# EAGLE design adsr2 (EAGLE 7.1.0)
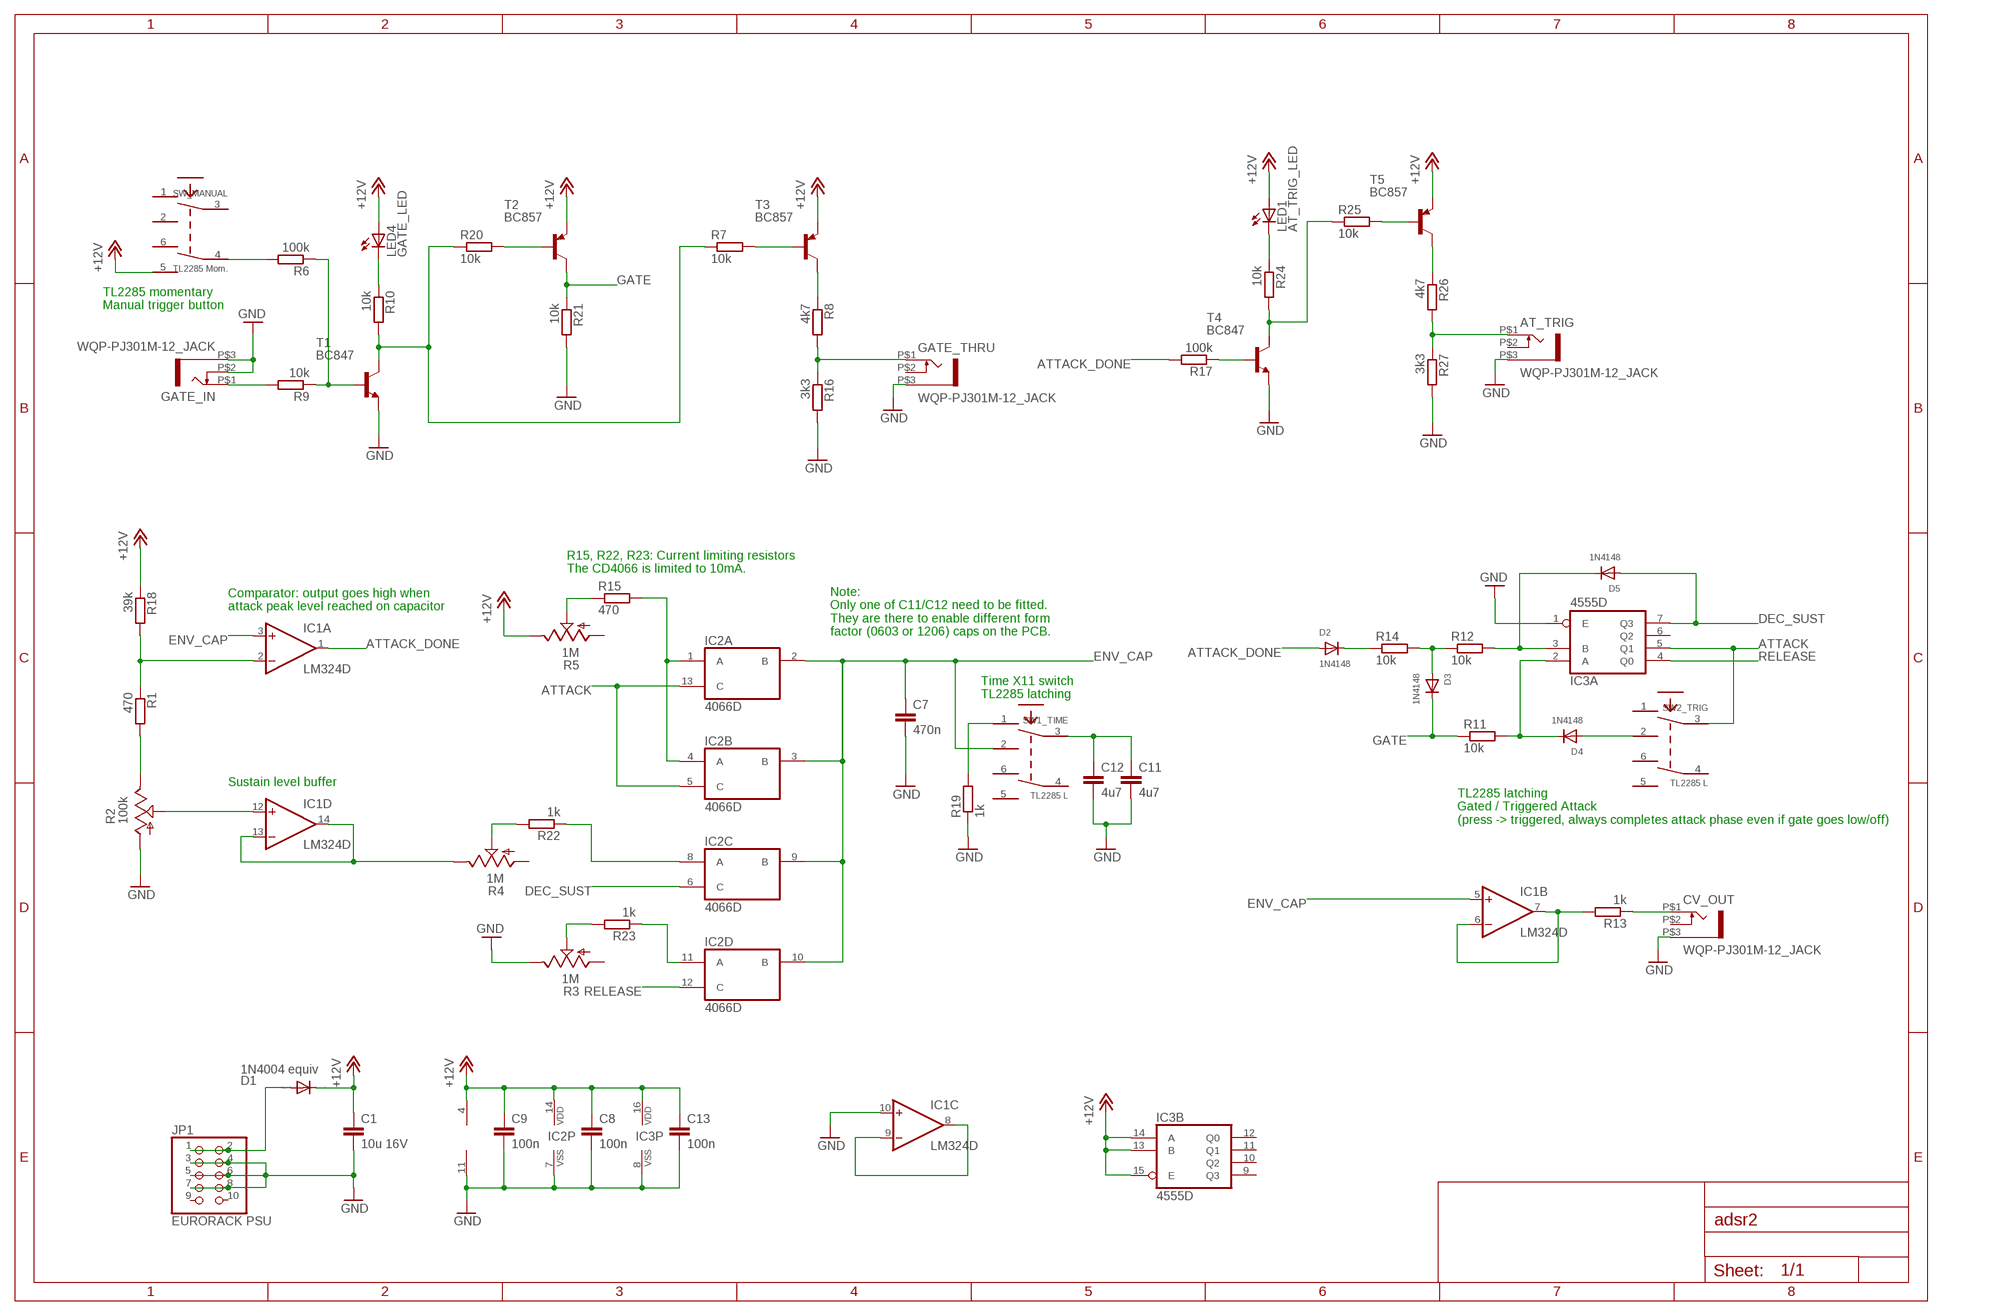
[diagram p0: schematic, sheet 1]

## Parts
AT_TRIG  WQP-PJ301M-12_JACK  [WQP-PJ301M-12_JACK]
C1  10u 16V  C-EUC1206K  [C1206K]
C7  470n  C-EUC0603K  [C0603K]
C8  100n  C-EUC0603K  [C0603K]
C9  100n  C-EUC0603K  [C0603K]
C11  4u7  C-EUC1206K  [C1206K]
C12  4u7  C-EUC0603K  [C0603K]
C13  100n  C-EUC0603K  [C0603K]
CV_OUT  WQP-PJ301M-12_JACK  [WQP-PJ301M-12_JACK]
D1  1N4004 equiv  DIODE-DO214AA  [DO214AA]
D2  1N4148  DIODESOD-323F  [SOD-323F]
D3  1N4148  DIODESOD-323F  [SOD-323F]
D4  1N4148  DIODESOD-323F  [SOD-323F]
D5  1N4148  DIODESOD-323F  [SOD-323F]
GATE_IN  WQP-PJ301M-12_JACK  [WQP-PJ301M-12_JACK]
GATE_THRU  WQP-PJ301M-12_JACK  [WQP-PJ301M-12_JACK]
IC1  LM324D  [SO14]
IC2  4066D  [SO14]
IC3  4555D  [SO16]
JP1  EURORACK PSU  PINHD-2X5  [2X05]
LED1  AT_TRIG_LED  LED3MM  [LED3MM]
LED4  GATE_LED  LED3MM  [LED3MM]
R1  470  R-EU_R0603  [R0603]
R2  100k  POT_USVERTICAL  [ALPS_POT_VERTICAL]
R3  1M  POT_USVERTICAL  [ALPS_POT_VERTICAL]
R4  1M  POT_USVERTICAL  [ALPS_POT_VERTICAL]
R5  1M  POT_USVERTICAL  [ALPS_POT_VERTICAL]
R6  100k  R-EU_R0603  [R0603]
R7  10k  R-EU_R0603  [R0603]
R8  4k7  R-EU_R0603  [R0603]
R9  10k  R-EU_R0603  [R0603]
R10  10k  R-EU_R0603  [R0603]
R11  10k  R-EU_R0603  [R0603]
R12  10k  R-EU_R0603  [R0603]
R13  1k  R-EU_R0603  [R0603]
R14  10k  R-EU_R0603  [R0603]
R15  470  R-EU_R0603  [R0603]
R16  3k3  R-EU_R0603  [R0603]
R17  100k  R-EU_R0603  [R0603]
R18  39k  R-EU_R0603  [R0603]
R19  1k  R-EU_R0603  [R0603]
R20  10k  R-EU_R0603  [R0603]
R21  10k  R-EU_R0603  [R0603]
R22  1k  R-EU_R0603  [R0603]
R23  1k  R-EU_R0603  [R0603]
R24  10k  R-EU_R0603  [R0603]
R25  10k  R-EU_R0603  [R0603]
R26  4k7  R-EU_R0603  [R0603]
R27  3k3  R-EU_R0603  [R0603]
SW1_TIME  TL2285 L  TL2285  [TL2285_PCB]
SW2_TRIG  TL2285 L  TL2285  [TL2285_PCB]
SW_MANUAL  TL2285 Mom.  TL2285  [TL2285_PCB]
T1  BC847  [SOT23]
T2  BC857  BC857A-PNP-SOT23-BEC  [SOT23-BEC]
T3  BC857  BC857A-PNP-SOT23-BEC  [SOT23-BEC]
T4  BC847  [SOT23]
T5  BC857  BC857A-PNP-SOT23-BEC  [SOT23-BEC]

## Nets
+12V: C1.1 C8.1 C9.1 C13.1 D1.C IC1.4(P:V+) IC2.14(P:VDD) IC3.13(B:B) IC3.14(B:A) IC3.15(B:E) IC3.16(P:VDD) LED1.A LED4.A R5.P$1(E) R18.1 SW_MANUAL.5 T2.E T3.E T5.E
ATTACK: IC2.5(B:C) IC2.13(A:C) IC3.5(A:Q1) SW2_TRIG.3
ATTACK_DONE: D2.A IC1.1(A:OUT) R17.2
ATTACK_REF: IC1.2(A:-IN) R1.1 R18.2
DEC_SUST: D5.A IC2.6(C:C) IC3.7(A:Q3)
ENV_CAP: C7.1 IC1.3(A:+IN) IC1.5(B:+IN) IC2.2(A:B) IC2.3(B:B) IC2.9(C:B) IC2.10(D:B) SW1_TIME.2
GATE: D3.C R11.1 R21.1 T2.C
GATE_IN: R7.1 R10.2 R20.1 T1.3(C)
GND: AT_TRIG.P$3 C1.2 C7.2 C8.2 C9.2 C11.2 C12.2 C13.2 CV_OUT.P$3 GATE_IN.P$2 GATE_IN.P$3 GATE_THRU.P$3 IC1.10(C:+IN) IC1.11(P:V-) IC2.7(P:VSS) IC3.1(A:E) IC3.8(P:VSS) JP1.3 JP1.4 JP1.5 JP1.6 JP1.7 JP1.8 R2.P$3(A) R3.P$1(E) R16.2 R19.1 R21.2 R27.2 T1.2(E) T4.2(E)
N$1: R20.2 T2.B
N$2: GATE_IN.P$1 R9.2
N$3: D1.A JP1.1 JP1.2
N$4: R6.2 SW_MANUAL.4
N$5: IC2.11(D:A) R23.1
N$6: IC2.8(C:A) R22.1
N$7: IC1.13(D:-IN) IC1.14(D:OUT) R4.P$1(E)
N$8: R7.2 T3.B
N$9: R8.1 T3.C
N$10: IC2.1(A:A) IC2.4(B:A) R15.2
N$11: CV_OUT.P$1 R13.1
N$12: IC1.6(B:-IN) IC1.7(B:OUT) R13.2
N$13: GATE_THRU.P$1 R8.2 R16.1
N$15: R4.P$2(S) R22.2
N$16: C11.1 C12.1 SW1_TIME.3
N$17: D3.A R12.1 R14.2
N$18: R19.2 SW1_TIME.1
N$19: R17.1 T4.1(B)
N$20: D5.C IC3.3(A:B) R12.2
N$21: R6.1 R9.1 T1.1(B)
N$22: LED4.K(C) R10.1
N$23: R3.P$2(S) R23.2
N$24: IC1.8(C:OUT) IC1.9(C:-IN)
N$25: D4.C IC3.2(A:A) R11.2
N$26: R1.2 R2.P$1(E)
N$27: D4.A SW2_TRIG.2
N$28: R5.P$2(S) R15.1
N$29: D2.C R14.1
N$30: R24.2 R25.1 T4.3(C)
N$31: LED1.K(C) R24.1
N$33: R25.2 T5.B
N$34: R26.1 T5.C
N$35: AT_TRIG.P$1 R26.2 R27.1
RELEASE: IC2.12(D:C) IC3.4(A:Q0)
SUST_LEVEL: IC1.12(D:+IN) R2.P$2(S)
Unconnected: AT_TRIG.P$2 CV_OUT.P$2 GATE_THRU.P$2 IC3.6(A:Q2) IC3.9(B:Q3) IC3.10(B:Q2) IC3.11(B:Q1) IC3.12(B:Q0) JP1.9 JP1.10 R3.P$3(A) R4.P$3(A) R5.P$3(A) SW1_TIME.4 SW1_TIME.5 SW1_TIME.6 SW2_TRIG.1 SW2_TRIG.4 SW2_TRIG.5 SW2_TRIG.6 SW_MANUAL.1 SW_MANUAL.2 SW_MANUAL.3 SW_MANUAL.6

## Notes on the sheet
- TL2285 momentary
  Manual trigger button
- R15, R22, R23: Current limiting resistors
  The CD4066 is limited to 10mA.
- Comparator: output goes high when
  attack peak level reached on capacitor
- Note:
  Only one of C11/C12 need to be fitted.
  They are there to enable different form
  factor (0603 or 1206) caps on the PCB.
- Time X11 switch
  TL2285 latching
- Sustain level buffer
- TL2285 latching
  Gated / Triggered Attack
  (press -> triggered, always completes attack phase even if gate goes low/off)

## Library data of the parts
AT_TRIG CV_OUT GATE_IN GATE_THRU = thonkiconn:WQP-PJ301M-12_JACK
C1 C7-C9 C11-C13 = rcl:C-EU: CAPACITOR, European symbol
D1 = diode:DIODE-: DIODE
D2-D5 = adafruit:DIODE: Diode SMADIODE - SMA Surface Mount Package 20V 1A Schottky Diode Digikey: 641-1014-6-ND DO-1N4148 - Through Hole Small Current Diode SOD-123 20V 1 A (.5mV Vf) Schottky Diode - Digikey: MBRX120TPMSCT-ND SOD-323 10V 570mA (.38mV Vf, 3ns) Schottky Diode - Digikey: ZLLS410CT-ND SOD-523 30V 30mA Schottky Diode (RB751S-40TE61) - Digikey: RB751S-40TE61CT-ND SOT23-R/W - SOT23 Package (R = Solder Paste/Reflow Ovens, W = Hand-Soldering) BAT54Film 40V 300mA - Digikey: 497-7162-1-ND
IC1 = linear:LM324: OP AMP
IC2 = 40xx:4066: Quad bilateral ANALOG SWITCH
IC3 = 45xx:4555: Dual binary 1 of 4 DECODER/DEMULTIPLEXER
JP1 = pinhead:PINHD-2X5: PIN HEADER
LED1 LED4 = led:LED: LED OSRAM: - CHIPLED LG R971, LG N971, LY N971, LG Q971, LY Q971, LO R971, LY R971 LH N974, LH R974 LS Q976, LO Q976, LY Q976 LO Q996 - Hyper CHIPLED LW Q18S LB Q993, LB Q99A, LB R99A - SideLED LS A670, LO A670, LY A670, LG A670, LP A670 LB A673, LV A673, LT A673, LW A673 LH A674 LY A675 LS A676, LA A676, LO A676, LY A676, LW A676 LS A679, LY A679, LG A679 - Hyper Micro SIDELED® LS Y876, LA Y876, LO Y876, LY Y876 LT Y87S - SmartLED LW L88C, LW L88S LB L89C, LB L89S, LG L890 LS L89K, LO L89K, LY L89K LS L896, LA L896, LO L896, LY L896 - TOPLED LS T670, LO T670, LY T670, LG T670, LP T670 LSG T670, LSP T670, LSY T670, LOP T670, LYG T670 LG T671, LOG T671, LSG T671 LB T673, LV T673, LT T673, LW T673 LH T674 LS T676, LA T676, LO T676, LY T676, LB T676, LH T676, LSB T676, LW T676 LB T67C, LV T67C, LT T67C, LS T67K, LO T67K, LY T67K, LW E67C LS E67B, LA E67B, LO E67B, LY E67B, LB E67C, LV E67C, LT E67C LW T67C LS T679, LY T679, LG T679 LS T770, LO T770, LY T770, LG T770, LP T770 LB T773, LV T773, LT T773, LW T773 LH T774 LS E675, LA E675, LY E675, LS T675 LS T776, LA T776, LO T776, LY T776, LB T776 LHGB T686 LT T68C, LB T68C - Hyper Mini TOPLED® LB M676 - Mini TOPLED Santana® LG M470 LS M47K, LO M47K, LY M47K Source: http://www.osram.convergy.de LUXEON: - LUMILED® LXK2-PW12-R00, LXK2-PW12-S00, LXK2-PW14-U00, LXK2-PW14-V00 LXK2-PM12-R00, LXK2-PM12-S00, LXK2-PM14-U00 LXK2-PE12-Q00, LXK2-PE12-R00, LXK2-PE12-S00, LXK2-PE14-T00, LXK2-PE14-U00 LXK2-PB12-K00, LXK2-PB12-L00, LXK2-PB12-M00, LXK2-PB14-N00, LXK2-PB14-P00, LXK2-PB14-Q00 LXK2-PR12-L00, LXK2-PR12-M00, LXK2-PR14-Q00, LXK2-PR14-R00 LXK2-PD12-Q00, LXK2-PD12-R00, LXK2-PD12-S00 LXK2-PH12-R00, LXK2-PH12-S00 LXK2-PL12-P00, LXK2-PL12-Q00, LXK2-PL12-R00 Source: www.luxeon.com KINGBRIGHT: KA-3528ASYC Source: www.kingbright.com
R1 R6-R27 = rcl:R-EU_: RESISTOR, European symbol
R2-R5 = pot-alps:POT_US
SW1_TIME SW2_TRIG SW_MANUAL = lb_devs:TL2285: E-Switch TL2285 (PCB switch)
T1 T4 = transistor:BC847: NPN TRANSISTOR
T2 T3 T5 = transistor:*-PNP-: PNP Transistror

## Board
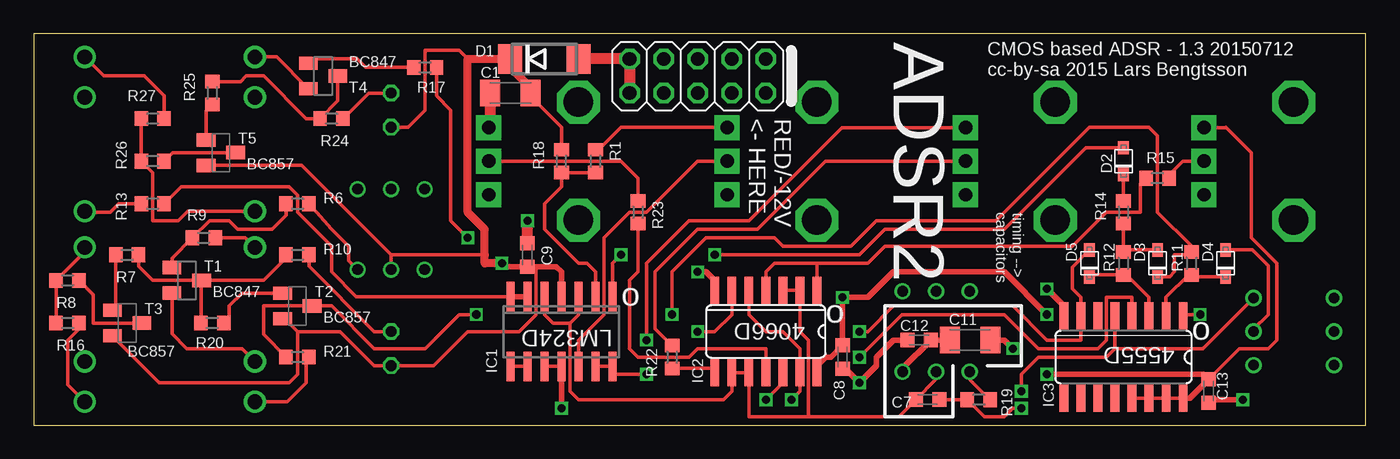
[diagram p1: board, top side]
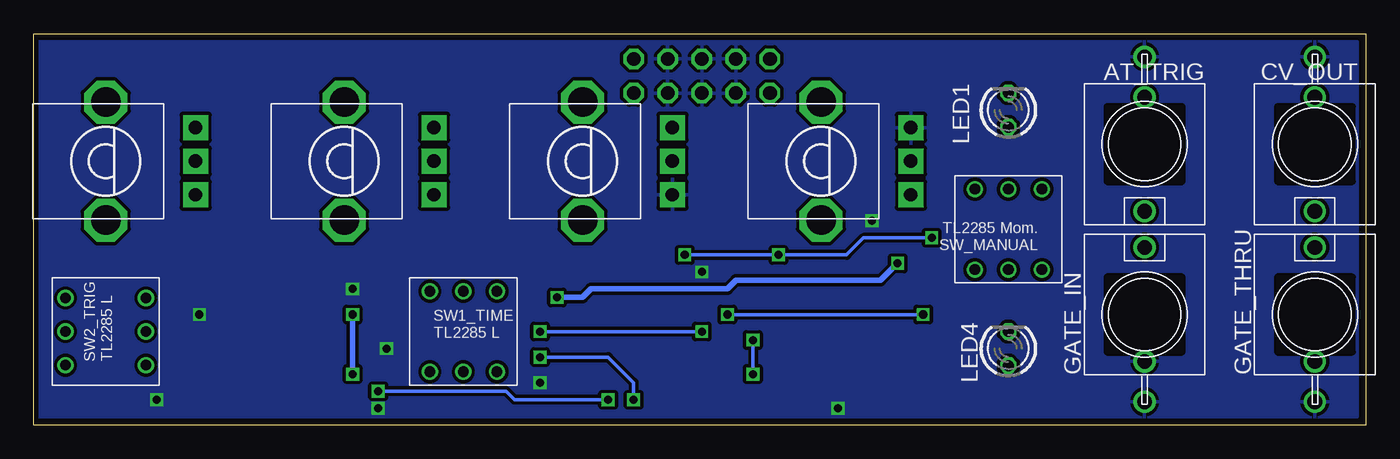
[diagram p2: board, bottom side, seen from below]

Size 99.36 x 29.2 mm. Coordinates in mm from the lower left corner, seen from the top.
Outline: 0,0 99.36,0 99.36,29.2 0,29.2 0,0
Copper layers (1*16): Top 0.0356mm / dielectric 1.5011mm / Bottom 0.0356mm
Design rules "LaenPCBOrder *": minimum track width 6mil, minimum drill 13mil, track to track 6mil, track to pad 6mil, pad to pad 6mil, via to via 6mil, smd to smd 6mil, copper to edge 15mil, drill to drill 6mil, minimum pad ring 7mil, minimum via ring 7mil, stop-mask expansion 3mil, vias tented up to drill 0mil, thermal gap 10mil

### Footprints (pad centres in the part's own frame; a part is rotated, then mirrored left to right if it is on the bottom)
WQP-PJ301M-12_JACK = drill 1.1: P$1 0,5; P$2 0,-3.5; P$3 0,-6.5
C1206K = smd 1.5 x 2: 1 -1.5,0; 2 1.5,0
C0603K = smd 1.05 x 1.08: 1 -0.875,0; 2 0.875,0
DO214AA = smd 1.8 x 2.2: A 2.55,0; C -2.55,0
SOD-323F = smd 1 x 0.8: A -1,0; C 1,0
SO14 = smd 0.6 x 2.2: 1 -3.81,-2.6; 2 -2.54,-2.6; 3 -1.27,-2.6; 4 0,-2.6; 5 1.27,-2.6; 6 2.54,-2.6; 7 3.81,-2.6; 8 3.81,2.6; 9 2.54,2.6; 10 1.27,2.6; 11 0,2.6; 12 -1.27,2.6; 13 -2.54,2.6; 14 -3.81,2.6
SO14' = smd 0.66 x 2.032: 1 -3.81,-3.073; 2 -2.54,-3.073; 3 -1.27,-3.073; 4 0,-3.073; 5 1.27,-3.073; 6 2.54,-3.073; 7 3.81,-3.073; 8 3.81,3.073; 9 2.54,3.073; 10 1.27,3.073; 11 0,3.073; 12 -1.27,3.073; 13 -2.54,3.073; 14 -3.81,3.073
SO16 = smd 0.66 x 2.032: 1 -4.445,-3.073; 2 -3.175,-3.073; 3 -1.905,-3.073; 4 -0.635,-3.073; 5 0.635,-3.073; 6 1.905,-3.073; 7 3.175,-3.073; 8 4.445,-3.073; 9 4.445,3.073; 10 3.175,3.073; 11 1.905,3.073; 12 0.635,3.073; 13 -0.635,3.073; 14 -1.905,3.073; 15 -3.175,3.073; 16 -4.445,3.073
2X05 = drill 1.016 octagon: 1 -5.08,-1.27; 2 -5.08,1.27; 3 -2.54,-1.27; 4 -2.54,1.27; 5 0,-1.27; 6 0,1.27; 7 2.54,-1.27; 8 2.54,1.27; 9 5.08,-1.27; 10 5.08,1.27
LED3MM = drill 0.813 octagon: A -1.27,0; K 1.27,0
R0603 = smd 1 x 1.1: 1 -0.85,0; 2 0.85,0
ALPS_POT_VERTICAL = drill 1 pad 1.88 square: P$1 -2.5,6.7; P$2 0,6.7; P$3 2.5,6.7 | drill 2.2 pad 3.175 octagon: P$4 -4.4,0; P$5 4.4,0
TL2285_PCB = drill 0.8: 1 -2.5,-3; 2 0,-3; 3 2.5,-3; 4 -2.5,3; 5 0,3; 6 2.5,3
SOT23 = smd 1 x 1.4: 1 -0.95,-1.1; 2 0.95,-1.1; 3 0,1.1
SOT23-BEC = smd 1 x 1.4: B -0.95,-1.1; C 0,1.1; E 0.95,-1.1

### Placement (x,y rotation side)
AT_TRIG  16.51,20.95 180 bottom
C1  35.56,24.77 180 top
C7  66.67,1.9 0 top
C8  60.33,5.08 270 top
C9  36.83,12.7 90 top
C11  69.85,6.35 0 top
C12  66.04,6.35 180 top
C13  87.63,2.54 270 top
CV_OUT  3.81,20.95 180 bottom
D1  38.1,27.3 0 top
D2  81.28,19.69 270 top
D3  83.82,12.06 270 top
D4  88.9,12.06 270 top
D5  78.74,12.06 270 top
GATE_IN  16.51,8.26 0 bottom
GATE_THRU  3.81,8.26 0 bottom
IC1  39.37,6.99 180 top
IC2  4066D  [SO14']  54.61,6.99 180 top
IC3  81.28,5.08 180 top
JP1  49.53,26.03 0 top
LED1  26.67,23.49 90 bottom
LED4  26.67,5.72 90 bottom
R1  41.91,19.69 90 top
R2  58.42,19.69 270 bottom
R3  40.64,19.69 270 bottom
R4  76.2,19.69 270 bottom
R5  93.98,19.69 270 bottom
R6  19.68,16.51 0 top
R7  6.99,12.7 180 top
R8  2.54,10.79 180 top
R9  12.7,13.97 0 top
R10  19.68,12.7 180 top
R11  86.36,12.06 270 top
R12  81.28,12.06 270 top
R13  8.89,16.51 0 top
R14  81.28,15.88 270 top
R15  83.82,18.41 180 top
R16  2.54,7.62 0 top
R17  29.21,26.67 0 top
R18  39.37,19.69 270 top
R19  70.48,1.9 0 top
R20  13.34,7.62 0 top
R21  19.68,5.08 0 top
R22  47.62,5.08 90 top
R23  45.09,15.88 90 top
R24  22.23,22.86 180 top
R25  13.34,24.77 270 top
R26  8.89,19.69 180 top
R27  8.89,22.86 0 top
SW1_TIME  67.31,6.99 0 bottom
SW2_TRIG  93.98,6.99 90 bottom
SW_MANUAL  26.67,14.6 180 bottom
T1  11.43,10.79 270 top
T2  19.68,8.89 270 top
T3  6.99,7.62 270 top
T4  21.59,26.03 270 top
T5  13.97,20.32 270 top

### Tracks (layer width: path | path; a pad name or v marks a point on that pad's centre or on a via)
+12V  (via drill 0.6)
  Top 0.254: IC3.16 IC3.15 IC3.14 IC3.13 | T2.E 18.73,7.94 19.68,6.99 | 19.68,6.99 22.86,6.99 25.4,4.45 LED4.A 29.84,4.45 32.38,6.99 36.2,6.99 37.47,8.26 37.47,11.83 | 19.68,6.99 19.68,3.81 19.05,3.18 9.38,3.18 T3.E | 32.38,27.3 31.75,27.94 29.21,27.94 29.21,23.49 27.94,22.23 LED1.A | T5.E 20,19.37 26.67,12.7 | 26.67,12.7 SW_MANUAL.5 | R5.P$1 88.86,22.18 88.9,22.23 90.81,20.32 90.81,13.97 92.71,12.06 92.71,6.35 92.08,5.72 89.93,5.72 C13.1 | 26.67,12.7 33.66,12.7 | C1.1 37.06,24.53 39.37,22.23 R18.1
  Top 0.406: IC2.14 58.42,4.45 59.05,5.08 59.45,5.08 C8.1 v60.33,9.53 62.23,9.53 64.14,11.43 72.39,11.43 v75.56,8.26 | v75.56,3.81 87.23,3.81 C13.1 86.22,2.01 IC3.16 | v34.92,12.06 35.16,11.83 C9.1 37.47,11.83 38.98,11.83 39.37,11.43 IC1.4
  Top 0.61: v34.92,12.06 33.66,12.06 33.66,12.7 33.66,14.6 32.38,15.88 32.38,27.3 D1.C 35.55,26.68 36.83,25.4 36.83,24.99 C1.1
  Bottom 0.406: v34.92,12.06 36.2,10.79 46.99,10.79 47.62,10.16 57.78,10.16 58.42,9.53 v60.33,9.53 | v75.56,3.81 v75.56,8.26
ATTACK  (via drill 0.6)
  Top 0.254: IC2.5 53.34,8.26 54.61,6.99 55.88,6.99 57.15,5.72 IC2.13 57.15,2.54 v56.52,1.9 | 80.64,5.72 87.21,5.72 SW2_TRIG.3 | 80.64,5.72 IC3.5 | v73.66,2.54 73.66,3.81 74.93,5.08 80.01,5.08 80.64,5.72
  Bottom 0.254: v56.52,1.9 63.5,1.9 64.14,2.54 v73.66,2.54
ATTACK_DONE  (via drill 0.6)
  Top 0.254: v50.8,12.7 61.59,12.7 63.5,14.6 72.39,14.6 78.47,20.69 D2.A | v43.81,12.7 43.18,12.06 IC1.1 | v32.38,13.97 31.11,15.24 31.11,23.49 30.06,24.55 R17.2
  Bottom 0.254: v50.8,12.7 v43.81,12.7 38.73,12.7 37.47,13.97 v32.38,13.97
ATTACK_REF
  Top 0.254: R1.1 R18.2 39.37,17.78 38.1,16.51 38.1,14.6 40.64,12.06 41.27,12.06 41.91,11.43 IC1.2
DEC_SUST  (via drill 0.6)
  Top 0.254: IC2.6 52.07,8.26 50.8,6.99 v49.53,6.99 | v61.59,6.99 62.23,6.99 64.14,8.89 73.03,8.89 75.56,6.35 78.11,6.35 IC3.7 78.11,9.53 77.47,10.16 77.47,11.79 D5.A
  Bottom 0.254: v49.53,6.99 v61.59,6.99
ENV_CAP
  Top 0.254: IC2.3 IC2.2 | 57.78,0.63 53.34,0.63 IC2.10 IC2.9 52.07,2.54 51.44,1.9 40.64,1.9 40.01,2.54 40.01,7.62 | 57.78,0.63 57.78,6.35 57.15,6.99 IC2.2 | IC1.5 38.1,8.26 38.73,7.62 40.01,7.62 | 40.01,7.62 40.64,8.26 IC1.3 | IC2.2 57.15,10.16 | 57.78,0.63 64.53,0.63 C7.1 67.31,3.42 SW1_TIME.2
GATE  (via drill 0.6)
  Top 0.254: v47.62,8.26 47.62,11.43 50.16,13.97 55.24,13.97 55.88,13.33 60.96,13.33 62.87,15.24 71.75,15.24 78.74,22.23 83.19,22.23 83.82,21.59 83.82,15.88 86.36,13.33 R11.1 | R11.1 86.36,12.7 | v33.02,8.26 31.75,8.26 29.21,5.72 25.4,5.72 22.23,8.89 T2.C 17.14,8.89 17.14,6.77 R21.1 | D3.C 84.72,11.06 85.09,11.43 85.09,12.7 86.14,12.7 R11.1
  Bottom 0.254: v33.02,8.26 v47.62,8.26
GATE_IN
  Top 0.254: R10.2 18.84,12.49 17.14,10.79 T1.3 | R7.1 7.83,11.85 8.89,10.79 T1.3 | R20.1 12.48,10.75 T1.3
GND  (via drill 0.6)
  Top 0.254: v87,8.26 85.72,8.26 IC3.1 | 50.8,9.53 IC2.7 | GATE_IN.P$3 18.9,1.76 20.32,3.18 20.32,4.87 R21.2 | C7.2 R19.1 70.91,0.63 72.39,0.63 73.03,1.27 v73.66,1.27 | IC1.10 IC1.11 | AT_TRIG.P$3 18.12,27.45 T4.2 | T1.2 10.33,6.81 11.43,5.72 15.55,5.72 GATE_IN.P$2 | R16.2 3.39,7.2 2.54,6.35 2.54,3.03 GATE_THRU.P$3 | R27.2 9.74,24.55 8.26,26.03 5.23,26.03 CV_OUT.P$3
  Top 0.406: v39.37,1.27 IC1.11 | v75.56,10.16 76.83,8.89 IC3.8 | C8.2 60.56,4.21 v61.59,3.18 62.87,4.45 62.87,5.08 64.14,6.35 C12.2 | C11.2 72.39,6.35 v73.03,5.72 | v90.17,1.9 87.87,1.9 C13.2 | v49.53,11.43 50.16,11.43 50.8,10.79 IC2.7
  Top 0.813: C1.2 34.06,22.3 R3.P$1 | C9.2 v36.83,15.24
  pour Bottom (isolate 0.254): 0.64,28.57 99.06,28.57 99.06,0.63 0.64,0.63
N$1
  Top 0.254: T2.B 15.55,9.84 14.61,8.89 14.61,8.04 R20.2
N$2
  Top 0.254: R9.2 15.79,13.97 GATE_IN.P$1
N$3
  Top 0.813: JP1.1 JP1.2 D1.A
N$4
  Top 0.254: R6.2 22.23,14.6 23.5,13.33 23.5,12.28 SW_MANUAL.4
N$5
  Top 0.254: IC2.11 54.61,5.72 49.53,5.72 48.9,5.08 45.09,5.08 44.45,5.72 44.45,10.79 45.09,11.43 R23.1
N$6
  Top 0.254: R22.1 50.48,4.23 IC2.8
N$7  (via drill 0.6)
  Top 0.254: IC1.13 IC1.14 43.18,3.81 v45.72,3.81 | R4.P$1 60.28,22.18 53.34,15.24 48.9,15.24 45.72,12.06 v45.72,6.35
  Bottom 0.254: v45.72,6.35 v45.72,3.81
N$8
  Top 0.254: R7.2 6.13,8.82 T3.B
N$9
  Top 0.254: T3.C 4.45,7.62 4.45,9.74 R8.1
N$10
  Top 0.254: IC2.4 54.61,11.43 55.24,12.06 58.42,12.06 | 58.42,12.06 IC2.1 | 58.42,12.06 62.23,12.06 63.5,13.33 77.47,13.33 80.01,15.88 82.55,15.88 82.55,17.99 R15.2
N$11
  Top 0.254: R13.1 6.35,16.51 5.71,15.88 3.89,15.88 CV_OUT.P$1
N$12
  Top 0.254: IC1.7 24.07,9.58 22.23,11.43 22.23,13.33 19.68,15.88 19.68,17.15 19.05,17.78 11.01,17.78 R13.2
  Top 0.406: IC1.7 IC1.6
N$13
  Top 0.254: GATE_THRU.P$1 3.81,12.92 R8.2 R16.1
N$15
  Top 0.254: R4.P$2 59.05,19.69 53.98,14.6 49.53,14.6 46.35,11.43 46.35,7.2 R22.2
N$16
  Top 0.406: SW1_TIME.3 64.81,4.24 C12.1 C11.1
N$17
  Top 0.254: D3.A 81.43,13.06 R12.1 R14.2
N$18
  Top 0.254: SW1_TIME.1 69.81,3.43 R19.2
N$19
  Top 0.254: R17.1 24.77,26.67 24.13,27.3 20.81,27.3 T4.1
N$20
  Top 0.254: IC3.3 83.19,9.53 81.5,11.22 R12.2 78.89,11.22 D5.C
N$21
  Top 0.254: T1.1 10.33,12.45 R9.1 13.12,15.24 14.61,15.24 15.24,14.6 17.78,14.6 18.84,15.66 R6.1
N$22
  Top 0.254: R10.1 20.54,11.85 25.4,6.99 LED4.K
N$23
  Top 0.254: R3.P$2 43.81,19.69 45.09,18.41 R23.2
N$24
  Top 0.254: IC1.9 IC1.8
N$25
  Top 0.254: IC3.2 84.45,9.53 86.14,11.22 R11.2 86.51,11.06 D4.C
N$26
  Top 0.254: R1.2 42.12,20.53 43.81,22.23 51.68,22.23 R2.P$1
N$27
  Top 0.254: D4.A 90.9,13.06 92.08,11.89 92.08,8.26 90.98,7.16 SW2_TRIG.2
N$28
  Top 0.254: R15.1 84.67,18.63 85.72,19.69 R5.P$2
N$29
  Top 0.254: D2.C R14.1
N$30
  Top 0.254: T4.3 22.69,24.17 R24.2 20.32,22.86 17.14,26.03 15.88,26.03 15.46,25.61 R25.1
N$31
  Top 0.254: LED1.K 24.98,24.77 R24.1
N$33
  Top 0.254: T5.B 12.87,23.45 R25.2
N$34
  Top 0.254: T5.C 10.38,20.32 R26.1
N$35
  Top 0.254: R27.1 R26.2 8.89,18.84 8.89,15.24 10.79,15.24 11.51,15.96 AT_TRIG.P$1
RELEASE  (via drill 0.6)
  Top 0.254: IC3.4 81.92,9.53 80.01,9.53 80.01,6.35 79.38,5.72 74.93,5.72 72.39,8.26 64.77,8.26 v61.59,5.08 | v54.61,1.9 55.88,3.18 IC2.12
  Bottom 0.254: v61.59,5.08 56.52,5.08 54.61,3.18 v54.61,1.9
SUST_LEVEL
  Top 0.254: IC1.12 40.64,6.35 42.55,8.26 42.55,13.97 44.45,15.88 45.72,15.88 49.53,19.69 R2.P$2

### Text on the board
tNames: ADSR2 | CMOS based ADSR - 1.3 20150712 / cc-by-sa 2015 Lars Bengtsson | RED/-12V / <- HERE | timing --> / capacitors | o | o | o